# EAGLE design tick-pi-mk-1.0 (EAGLE 7.5.0)
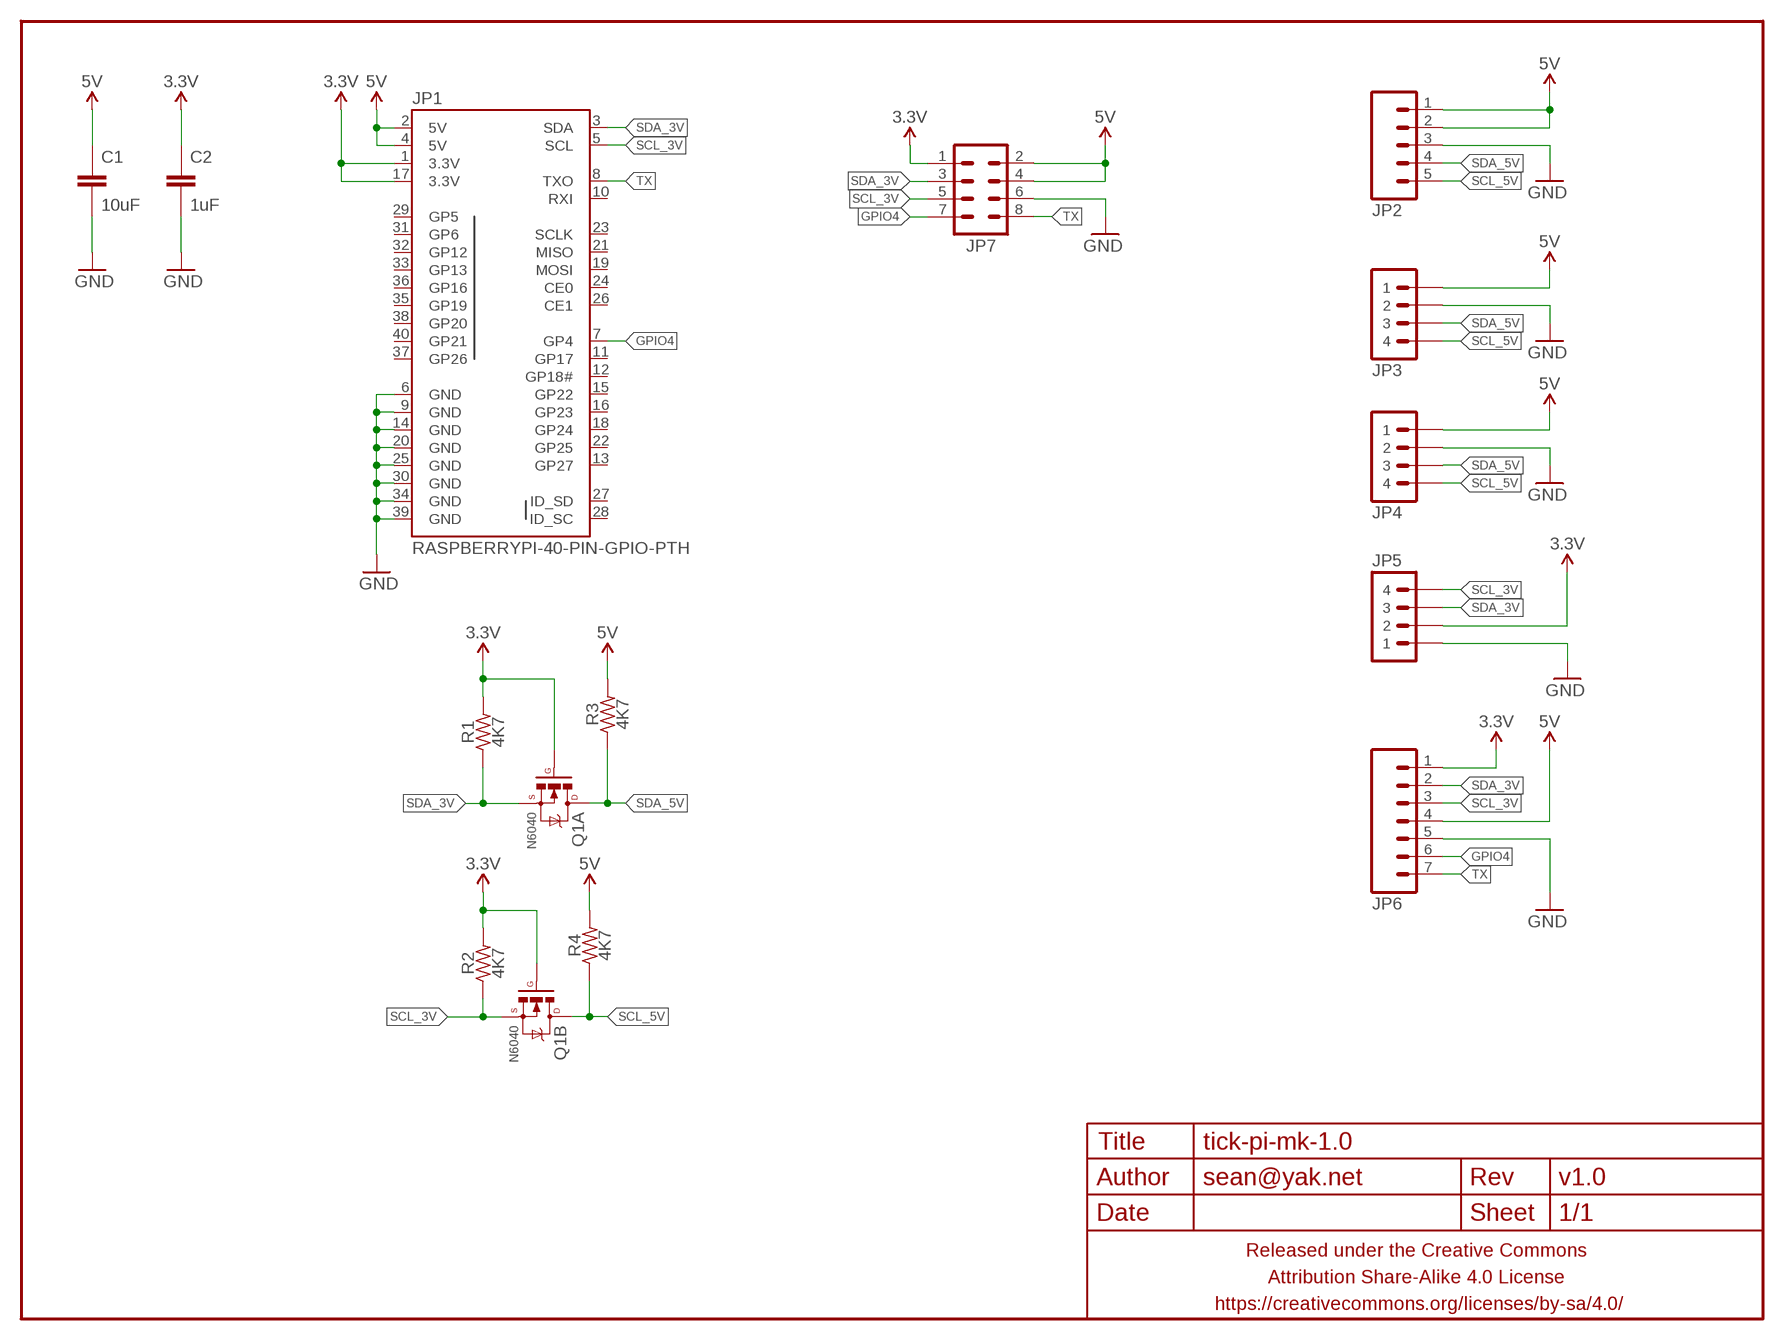
[diagram p0: schematic, sheet 1]

## Parts
C1  10uF  CAPACITOR-CERAMICC0805-TIGHTER  [C0805-TIGHTER]
C2  1uF  CAPACITOR-CERAMICC0805-TIGHTER  [C0805-TIGHTER]
FRAME1  FRAME-LETTERNO_PACKAGE  [DUMMY]
JP1  RASPBERRYPI-40-PIN-GPIO-PTH  [2X20_PTH]
JP2  M05PTH-CENTERED-RA-FEMALE  [1X05_PTH_CENTERED_RA_FEMALE]
JP3  M04PTH  [1X04-PTH-VERT]
JP4  M04PTH  [1X04-PTH-VERT]
JP5  M04PTH  [1X04-PTH-VERT]
JP6  M07  [1X07]
JP7  M04X2PTH  [2X4_PTH]
Q1  N6040  MOSFET-NCHANNEL-DUALSOIC8  [SO08]
R1  4K7  RESISTORR0603  [R0603]
R2  4K7  RESISTORR0603  [R0603]
R3  4K7  RESISTORR0603  [R0603]
R4  4K7  RESISTORR0603  [R0603]

## Nets
3.3V: C2.1 JP1.1(3.3V) JP1.17(3.3V) JP5.2 JP6.1 JP7.1 Q1.2(A:G) Q1.4(B:G) R1.2 R2.2
5V: C1.1 JP1.2(5V) JP1.4(5V) JP2.1 JP2.2 JP3.1 JP4.1 JP6.4 JP7.2 JP7.4 R3.2 R4.2
GND: C1.2 C2.2 JP1.6(GND) JP1.9(GND) JP1.14(GND) JP1.20(GND) JP1.25(GND) JP1.30(GND) JP1.34(GND) JP1.39(GND) JP2.3 JP3.2 JP4.2 JP5.1 JP6.5 JP7.6
GPIO4: JP1.7(GP4) JP6.6 JP7.7
SCL_3V: JP1.5(SCL) JP5.4 JP6.3 JP7.5 Q1.3(B:S) R2.1
SCL_5V: JP2.5 JP3.4 JP4.4 Q1.5(B:D) Q1.6(B:D) R4.1
SDA_3V: JP1.3(SDA) JP5.3 JP6.2 JP7.3 Q1.1(A:S) R1.1
SDA_5V: JP2.4 JP3.3 JP4.3 Q1.7(A:D) Q1.8(A:D) R3.1
TX: JP1.8(TXO) JP6.7 JP7.8
Unconnected: JP1.10(RXI) JP1.11(GP17) JP1.12(GP18#) JP1.13(GP27) JP1.15(GP22) JP1.16(GP23) JP1.18(GP24) JP1.19(MOSI) JP1.21(MISO) JP1.22(GP25) JP1.23(SCLK) JP1.24(CE0) JP1.26(CE1) JP1.27(ID_SD) JP1.28(ID_SC) JP1.29(GP5) JP1.31(GP6) JP1.32(GP12) JP1.33(GP13) JP1.35(GP19) JP1.36(GP16) JP1.37(GP26) JP1.38(GP20) JP1.40(GP21)

## Library data of the parts
C1 C2 = a_parts:CAPACITOR-CERAMIC: CAPACITOR, European symbol
FRAME1 = a_parts:FRAME-LETTER: Schematic Frame Standard 8.5x11 US Letter frame; DESIGNER: sean@yak.net; VERSION: v1.0
JP1 = a_parts:RASPBERRYPI-40-PIN-GPIO: Second Generation Raspberry Pi GPIO Header 2x20 pin connector, as found on B, B+, A+ models.
JP2 = a_parts:M05: Header 5 Standard 5-pin 0.1" header. Use with straight break away headers (SKU : PRT-00116), right angle break away headers (PRT-00553), swiss pins (PRT-00743), machine pins (PRT-00117), and female headers (PRT-00115). Molex polarized connector foot print use with SKU : PRT-08230 with associated crimp pins and housings.
JP3-JP5 = a_parts:M04: Header 4 Standard 4-pin 0.1" header. Use with straight break away headers (SKU : PRT-00116), right angle break away headers (PRT-00553), swiss pins (PRT-00743), machine pins (PRT-00117), and female headers (PRT-00115). Molex polarized connector foot print use with SKU : PRT-08231 with associated crimp pins and housings. 1MM SMD Version SKU: PRT-10208
JP6 = a_parts:M07: Header 7 Standard 7-pin 0.1" header. Use with straight break away headers (SKU : PRT-00116), right angle break away headers (PRT-00553), swiss pins (PRT-00743), machine pins (PRT-00117), and female headers (PRT-00115). NOTES ON THE VARIANTS LOCK and LOCK_LONGPADS... This footprint was designed to help hold the alignment of a through-hole component (i.e. 7-pin header) while soldering it into place. You may notice that each hole has been shifted either up or down by 0.005 of an inch from it's more standard position (which is usually a perfectly straight line). This slight alteration caused the pins (the squares in the middle) to touch the edges of the holes. Because they are alternating, it causes a "brace" to hold the header in place. 0.005 has proven to be the perfect amount of "off-center" position when using our standard breakaway headers. Although looks a little odd when you look at the bare footprint, once you have a header in there, the alteration is very hard to notice. Also, if you push a header all the way into place, it is covered up entirely on the bottom side. This idea of altering the position of holes to aid alignment will be further integrated into the Sparkfun Library for other footprints. It can help hold any component with 3 or more connection pins.
JP7 = a_parts:M04X2
Q1 = a_parts:MOSFET-NCHANNEL-DUAL: 2N7002DW-7-F Newark 66W0958 Digi-Key 2N7002DW-FDICT-ND
R1-R4 = a_parts:RESISTOR: RESISTOR, American symbol

## Board
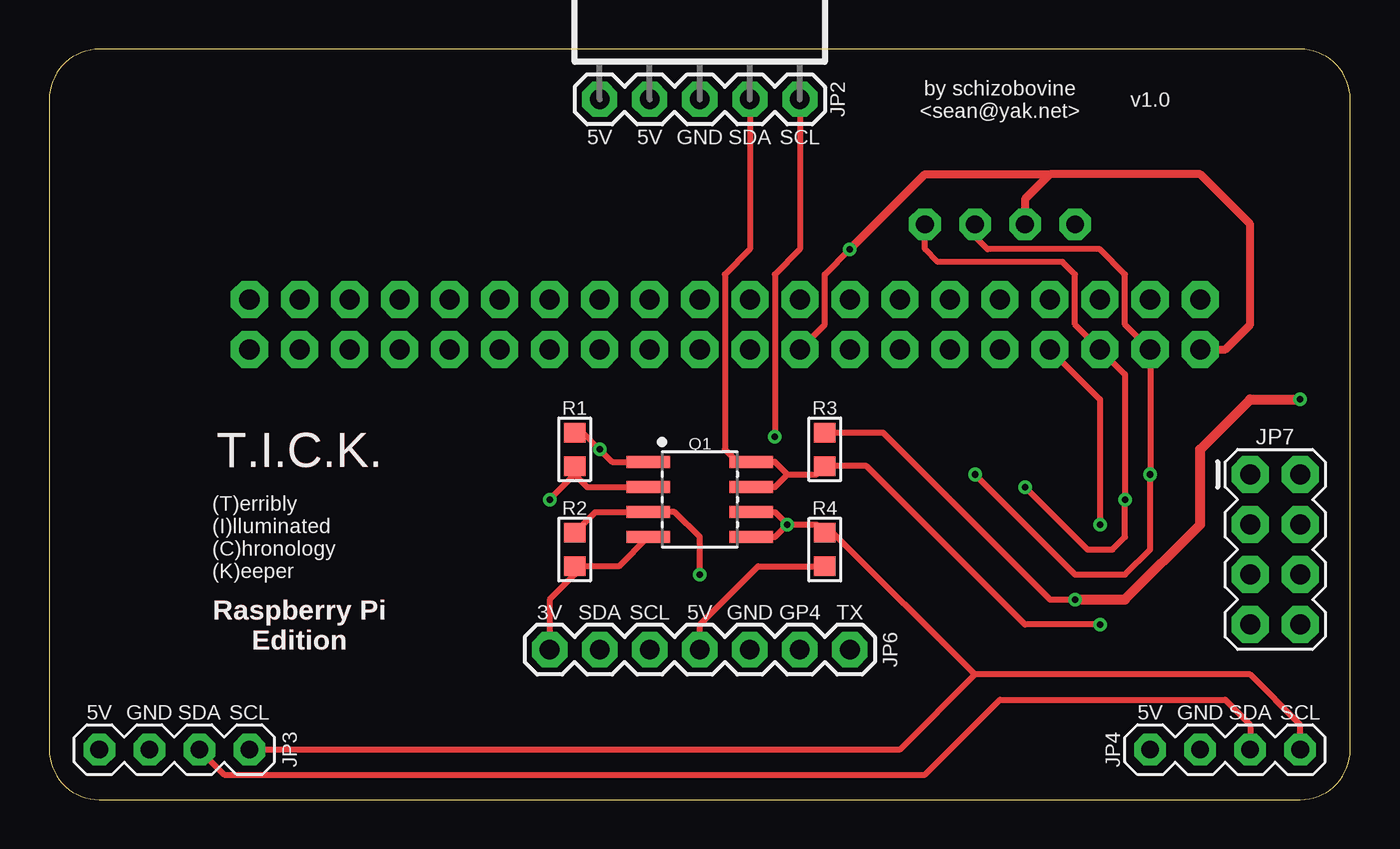
[diagram p1: board, top side]
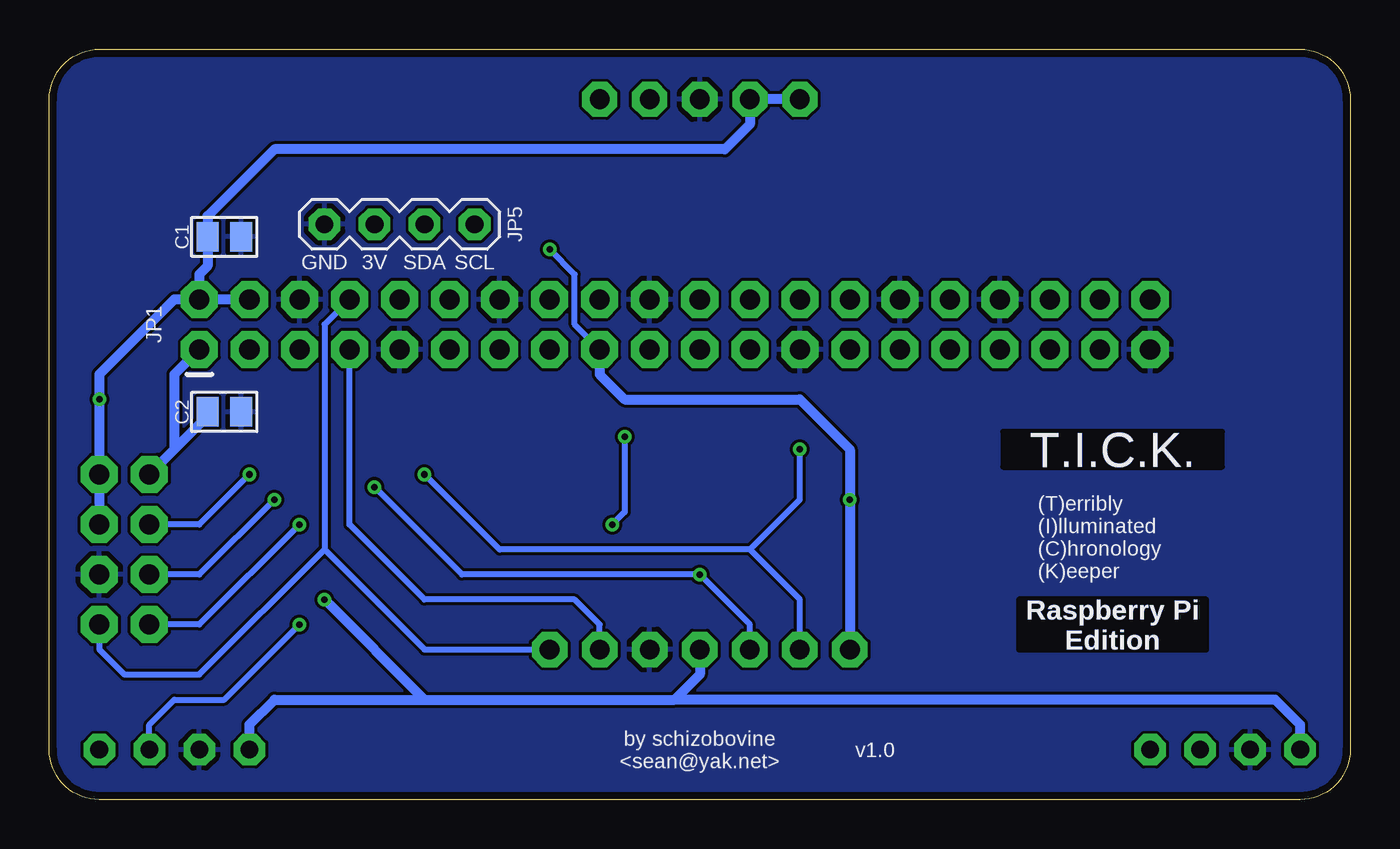
[diagram p2: board, bottom side, seen from below]

Size 66.04 x 38.1 mm. Coordinates in mm from the lower left corner, seen from the top.
Outline: 2.54,0 63.5,0 arc90 66.04,2.54 66.04,35.56 arc90 63.5,38.1 2.54,38.1 arc90 0,35.56 0,2.54 arc90 2.54,0
Copper layers (1*16): Top 0.0356mm / dielectric 1.5011mm / Bottom 0.0356mm
Design rules "LaenPCBOrder2": minimum track width 6mil, minimum drill 13mil, track to track 6mil, track to pad 6mil, pad to pad 6mil, via to via 6mil, smd to smd 6mil, copper to edge 15mil, drill to drill 6mil, minimum pad ring 7mil, minimum via ring 7mil, stop-mask expansion 3mil, vias tented up to drill 20mil, thermal gap 10mil

### Footprints (pad centres in the part's own frame; a part is rotated, then mirrored left to right if it is on the bottom)
C0805-TIGHTER = smd 1.1 x 1.5: 1 -0.85,0; 2 0.85,0
2X20_PTH = drill 1.016 pad 1.88 octagon: 1 -24.13,-1.27; 2 -24.13,1.27; 3 -21.59,-1.27; 4 -21.59,1.27; 5 -19.05,-1.27; 6 -19.05,1.27; 7 -16.51,-1.27; 8 -16.51,1.27; 9 -13.97,-1.27; 10 -13.97,1.27; 11 -11.43,-1.27; 12 -11.43,1.27; 13 -8.89,-1.27; 14 -8.89,1.27; 15 -6.35,-1.27; 16 -6.35,1.27; 17 -3.81,-1.27; 18 -3.81,1.27; 19 -1.27,-1.27; 20 -1.27,1.27; 21 1.27,-1.27; 22 1.27,1.27; 23 3.81,-1.27; 24 3.81,1.27; 25 6.35,-1.27; 26 6.35,1.27; 27 8.89,-1.27; 28 8.89,1.27; 29 11.43,-1.27; 30 11.43,1.27; 31 13.97,-1.27; 32 13.97,1.27; 33 16.51,-1.27; 34 16.51,1.27; 35 19.05,-1.27; 36 19.05,1.27; 37 21.59,-1.27; 38 21.59,1.27; 39 24.13,-1.27; 40 24.13,1.27
1X05_PTH_CENTERED_RA_FEMALE = drill 1 pad 1.778 octagon: 1 -5.08,0; 2 -2.54,0; 3 0,0; 4 2.54,0; 5 5.08,0
1X04-PTH-VERT = drill 0.9 pad 1.6 octagon: 1 0,0; 2 2.54,0; 3 5.08,0; 4 7.62,0
1X07 = drill 1 pad 1.8 octagon: 1 0,0; 2 2.54,0; 3 5.08,0; 4 7.62,0; 5 10.16,0; 6 12.7,0; 7 15.24,0
2X4_PTH = drill 1.016 pad 1.88 octagon: 1 -3.81,-1.27; 2 -3.81,1.27; 3 -1.27,-1.27; 4 -1.27,1.27; 5 1.27,-1.27; 6 1.27,1.27; 7 3.81,-1.27; 8 3.81,1.27
SO08 = smd 0.61 x 2.21: 1 -1.905,-2.616; 2 -0.635,-2.616; 3 0.635,-2.616; 4 1.905,-2.616; 5 1.905,2.616; 6 0.635,2.616; 7 -0.635,2.616; 8 -1.905,2.616
R0603 = smd 1 x 1.1: 1 -0.85,0; 2 0.85,0

### Placement (x,y rotation side)
C1  57.15,28.57 0 bottom
C2  57.15,19.68 0 bottom
FRAME1  0,0 0 top
JP1  34.29,24.13 0 bottom
JP2  33.02,35.56 0 top
JP3  2.54,2.54 0 top
JP4  55.88,2.54 0 top
JP5  52.07,29.21 0 bottom
JP6  25.4,7.62 0 top
JP7  62.23,12.7 270 top
Q1  33.02,15.24 270 top
R1  26.67,17.78 270 top
R2  26.67,12.7 270 top
R3  39.37,17.78 90 top
R4  39.37,12.7 270 top

### Tracks (layer width: path | path; a pad name or v marks a point on that pad's centre or on a via)
3.3V  (via drill 0.33)
  Top 0.305: R1.2 26.67,16.51 | 26.67,16.51 v25.4,15.24 | JP6.1 25.4,10.16 26.67,11.43 R2.2 28.92,11.85 Q1.4 | 26.67,16.51 27.3,15.88 Q1.2 | JP1.17 39.37,24.13 39.37,26.67 v40.64,27.94
  Top 0.406: JP1.1 59.69,22.86 60.96,24.13 60.96,29.21 58.42,31.75 50.8,31.75 | 50.8,31.75 49.53,30.48 JP5.2 | 50.8,31.75 44.45,31.75 v40.64,27.94
  Bottom 0.305: v40.64,27.94 39.37,26.67 39.37,24.13 JP1.17
  Bottom 0.508: JP1.1 59.69,21.59 59.69,17.78 | 59.69,17.78 JP7.1 | C2.1 58,19.47 59.69,17.78 | JP1.17 38.1,21.59 36.83,20.32 27.94,20.32 25.4,17.78 v25.4,15.24 JP6.1
5V  (via drill 0.33)
  Top 0.305: JP6.4 33.02,8.89 35.98,11.85 R4.2 | R3.2 42.33,18.63 50.8,10.16 v52.07,10.16
  Top 0.508: v52.07,10.16 54.61,10.16 58.42,13.97 58.42,17.78 60.96,20.32 v63.5,20.32
  Bottom 0.508: JP3.1 2.54,3.81 3.81,5.08 34.29,5.08 | JP4.1 55.88,3.81 54.61,5.08 46.99,5.08 | JP6.4 33.02,6.35 34.29,5.08 | JP1.2 59.69,25.4 63.5,21.59 v63.5,20.32 JP7.2 JP7.4 | JP1.2 58.42,26.67 58,27.09 C1.1 58,29.63 54.61,33.02 31.75,33.02 30.48,34.29 JP2.2 JP2.1 | JP1.4 JP1.2 | 46.99,5.08 34.29,5.08 | v52.07,10.16 46.99,5.08
GND
  pour Bottom: 66.04,35.56 66.04,2.54 arc-90 63.5,0 2.54,0 arc-90 0,2.54 0,35.56 arc-90 2.54,38.1 63.5,38.1 arc-90
GPIO4  (via drill 0.33)
  Top 0.305: JP1.7 53.34,20.32 v53.34,13.97
  Bottom 0.305: v53.34,13.97 58.42,8.89 JP7.7 | JP6.6 38.1,8.89 39.37,10.16 46.99,10.16 50.8,13.97 JP1.7
SCL_3V  (via drill 0.33)
  Top 0.305: JP5.4 44.45,27.94 45.09,27.3 51.44,27.3 52.07,26.67 52.07,24.13 JP1.5 54.61,21.59 v54.61,15.24 54.61,13.34 53.98,12.7 52.7,12.7 v49.53,15.88 | R2.1 27.73,14.61 Q1.3 31.75,14.61 33.02,13.34 v33.02,11.43
  Bottom 0.305: v54.61,15.24 58.42,11.43 JP7.5 | JP6.3 30.48,8.89 v33.02,11.43 45.09,11.43 v49.53,15.88
SCL_5V  (via drill 0.33)
  Top 0.305: JP4.4 63.5,3.81 60.96,6.35 46.99,6.35 | 46.99,6.35 43.18,2.54 JP3.4 | 46.99,6.35 39.79,13.55 R4.1 38.95,13.97 v37.47,13.97 | Q1.5 36.83,13.34 v37.47,13.97 | Q1.6 36.83,14.61 v37.47,13.97 | JP2.5 38.1,27.94 36.83,26.67 v36.83,18.41
  Bottom 0.305: v36.83,18.41 36.83,14.61 v37.47,13.97
SDA_3V  (via drill 0.33)
  Top 0.305: JP5.3 46.99,28.57 47.62,27.94 53.34,27.94 54.61,26.67 54.61,24.13 JP1.3 v55.88,16.51 55.88,12.7 54.61,11.43 52.07,11.43 v46.99,16.51 | R1.1 27.09,18.63 v27.94,17.78 28.57,17.14 Q1.1
  Bottom 0.305: v55.88,16.51 58.42,13.97 JP7.3 | JP6.2 27.94,10.16 30.48,12.7 | 30.48,12.7 43.18,12.7 v46.99,16.51 | 30.48,12.7 27.94,15.24 v27.94,17.78
SDA_5V  (via drill 0.33)
  Top 0.305: v53.34,8.89 49.53,8.89 41.49,16.93 R3.1 38.95,16.51 37.47,16.51 | JP3.3 8.89,1.27 44.45,1.27 48.26,5.08 59.69,5.08 60.96,3.81 JP4.3 | 37.47,16.51 36.83,15.88 Q1.7 | 37.47,16.51 36.83,17.14 Q1.8 34.92,17.14 34.29,17.78 34.29,26.67 35.56,27.94 JP2.4
  Bottom 0.305: JP4.3 60.96,3.81 59.69,5.08 57.15,5.08 v53.34,8.89
TX
  Bottom 0.305: JP7.8 63.5,7.62 62.23,6.35 58.42,6.35 52.07,12.7 | JP1.8 52.07,24.13 52.07,12.7 | 52.07,12.7 46.99,7.62 JP6.7

### Text on the board
Top: T.I.C.K. | Raspberry Pi / Edition
Bottom: T.I.C.K. | Raspberry Pi / Edition
tPlace: by schizobovine / <sean@yak.net> | 5V | 5V | GND | SDA | SCL | T.I.C.K. | (T)erribly / (I)lluminated / (C)hronology / (K)eeper | 3V | SDA | SCL | 5V | GND | GP4 | TX | Raspberry Pi / Edition | 5V | GND | SDA | SCL | 5V | GND | SDA | SCL
bPlace: SCL | SDA | 3V | GND | T.I.C.K. | (T)erribly / (I)lluminated / (C)hronology / (K)eeper | Raspberry Pi / Edition | by schizobovine / <sean@yak.net>